# Altium schematic sheet Stepper_control.SchDoc: Stepper Control
size A3; DrawnBy: Mogens Groth Nicolaisen; DocumentNumber: 4; SheetNumber: 4; SheetTotal: 7
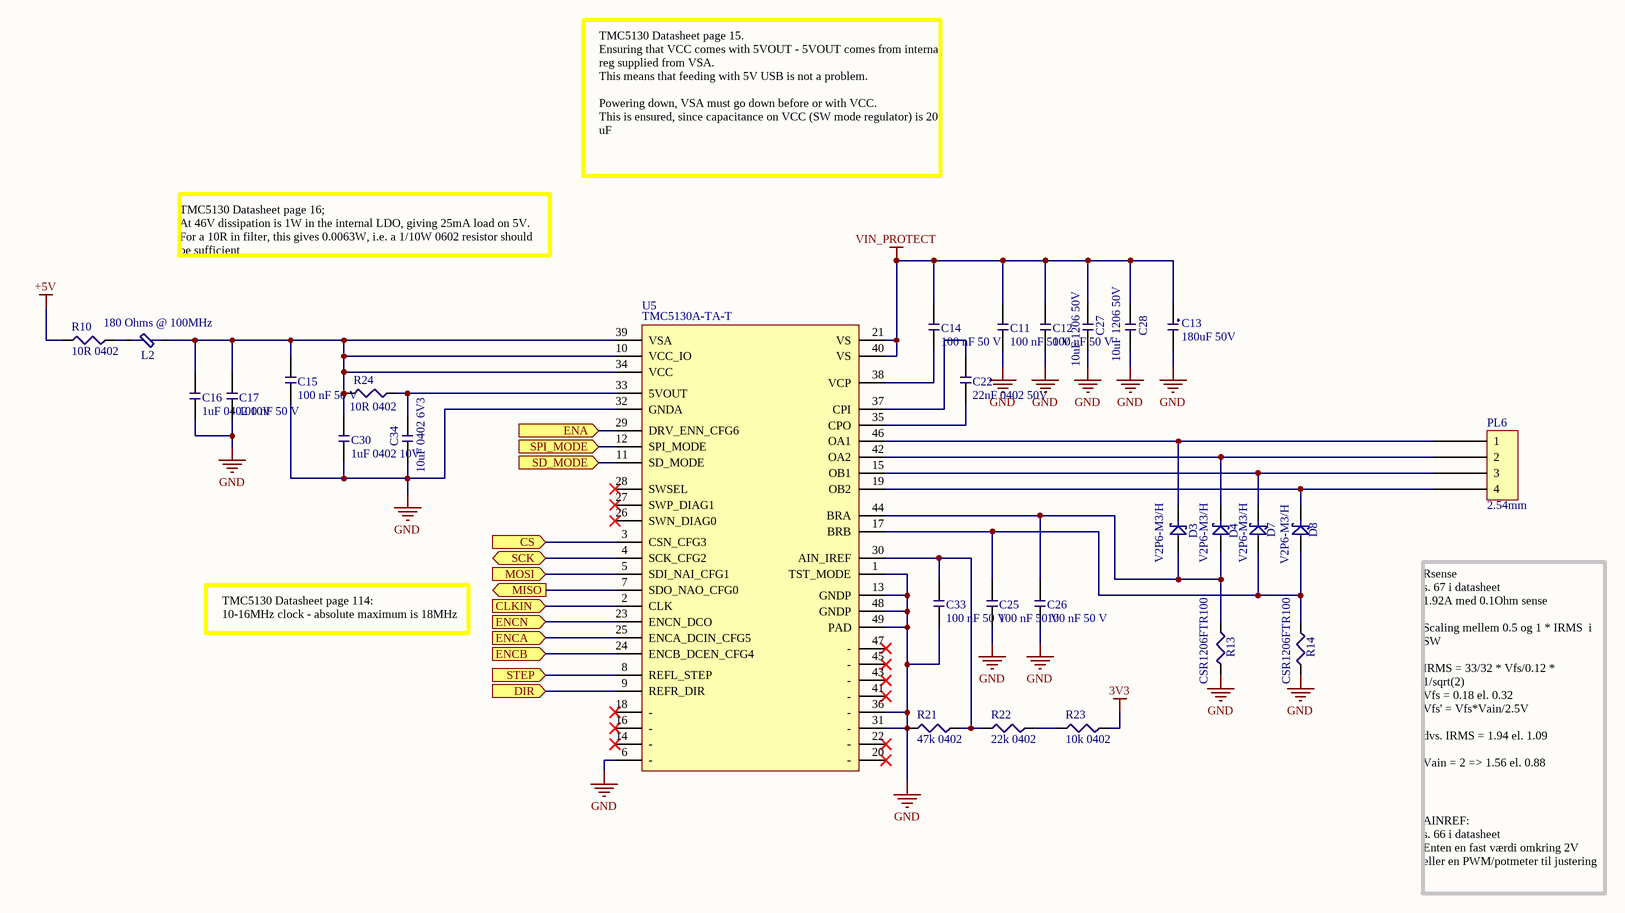
[diagram p0: Stepper_control.SchDoc]

## Parts
C11  100 nF 50 V  [CAP_0402]
C12  100 nF 50 V  [CAP_0402]
C13  180uF 50V  [Capacitor 8x22]
C14  100 nF 50 V  [CAP_0402]
C15  100 nF 50 V  [CAP_0402]
C16  1uF 0402 10V  [CAP_0402]
C17  100 nF 50 V  [CAP_0402]
C22  22nF 0402 50V  [CAP_0402]
C25  100 nF 50 V  [CAP_0402]
C26  100 nF 50 V  [CAP_0402]
C27  10uF 1206 50V  [CAP_1206]
C28  10uF 1206 50V  [CAP_1206]
C30  1uF 0402 10V  [CAP_0402]
C33  100 nF 50 V  [CAP_0402]
C34  10uF 0402 6V3  [CAP_0402]
D3  V2P6-M3/H  [MicroSMP]
D4  V2P6-M3/H  [MicroSMP]
D7  V2P6-M3/H  [MicroSMP]
D8  V2P6-M3/H  [MicroSMP]
L2  180 Ohms @ 100MHz  [IND_0603]
PL6  2.54mm  [4-pin 2.54mm header]
R10  10R 0402  [RES_0402]
R13  CSR1206FTR100  [RES_1206]
R14  CSR1206FTR100  [RES_1206]
R21  47k 0402  [RES_0402]
R22  22k 0402  [RES_0402]
R23  10k 0402  [RES_0402]
R24  10R 0402  [RES_0402]
U5  TMC5130A-TA-T  [TSQFP50P900X900X120_HS-49N]

## Ports
CLKIN (in), CS (in), DIR (in), ENA (in), ENCA (in), ENCB (in), ENCN (in), MISO (out), MOSI (in), SCK (bidir), SD_MODE (in), SPI_MODE (in), STEP (in)

## Nets
3V3: R23.1
+5V: R10.2
GND: C11.2 C12.2 C13.2 C15.2 C16.1 C17.2 C25.2 C26.2 C27.2 C28.2 C30.1 C33.2 C34.1 R13.1 R14.1 R21.2 U5.1(TST_MODE) U5.6(-) U5.13(GNDP) U5.31(-) U5.32(GNDA) U5.36(-) U5.48(GNDP) U5.49(PAD)
VIN_PROTECT: C11.1 C12.1 C13.1 C14.2 C27.1 C28.1 U5.21(VS) U5.40(VS)
CLKIN: U5.2(CLK) ; port CLKIN
CS: U5.3(CSN_CFG3) ; port CS
DIR: U5.9(REFR_DIR) ; port DIR
ENA: U5.29(DRV_ENN_CFG6) ; port ENA
ENCA: U5.25(ENCA_DCIN_CFG5) ; port ENCA
ENCB: U5.24(ENCB_DCEN_CFG4) ; port ENCB
ENCN: U5.23(ENCN_DCO) ; port ENCN
MISO: U5.7(SDO_NAO_CFG0) ; port MISO
MOSI: U5.5(SDI_NAI_CFG1) ; port MOSI
SCK: U5.4(SCK_CFG2) ; port SCK
SD_MODE: U5.11(SD_MODE) ; port SD_MODE
SPI_MODE: U5.12(SPI_MODE) ; port SPI_MODE
STEP: U5.8(REFL_STEP) ; port STEP
NetC14_1: C14.1 U5.38(VCP)
NetC15_1: C15.1 C16.2 C17.1 C30.2 L2.2 R24.1 U5.10(VCC_IO) U5.34(VCC) U5.39(VSA)
NetC22_1: C22.1 U5.35(CPO)
NetC22_2: C22.2 U5.37(CPI)
NetC25_1: C25.1 D7.1 D8.1 R14.2 U5.17(BRB)
NetC26_1: C26.1 D3.1 D4.1 R13.2 U5.44(BRA)
NetC33_1: C33.1 R21.1 R22.1 U5.30(AIN_IREF)
NetC34_2: C34.2 R24.2 U5.33(5VOUT)
NetD3_2: D3.2 PL6.1 U5.46(OA1)
NetD4_2: D4.2 PL6.2 U5.42(OA2)
NetD7_2: D7.2 PL6.3 U5.15(OB1)
NetD8_2: D8.2 PL6.4 U5.19(OB2)
NetL2_1: L2.1 R10.1
NetR22_2: R22.2 R23.2

Not connected (* = marked no-connect by the designer): U5 14(-)* 16(-)* 18(-)* 20(-)* 22(-)* 26(SWN_DIAG0)* 27(SWP_DIAG1)* 28(SWSEL)* 41(-)* 43(-)* 45(-)* 47(-)*

## Notes on the sheet
- TMC5130 Datasheet page 15.
  Ensuring that VCC comes with 5VOUT - 5VOUT comes from internal reg supplied from VSA.
  This means that feeding with 5V USB is not a problem.
  Powering down, VSA must go down before or with VCC.
  This is ensured, since capacitance on VCC (SW mode regulator) is 20 uF
- TMC5130 Datasheet page 16;
  At 46V dissipation is 1W in the internal LDO, giving 25mA load on 5V.
  For a 10R in filter, this gives 0.0063W, i.e. a 1/10W 0602 resistor should be sufficient
- TMC5130 Datasheet page 114:
  10-16MHz clock - absolute maximum is 18MHz
- Rsense
  s. 67 i datasheet
  1.92A med 0.1Ohm sense
  Scaling mellem 0.5 og 1 * IRMS  i SW
  IRMS = 33/32 * Vfs/0.12 * 1/sqrt(2)
  Vfs = 0.18 el. 0.32
  Vfs' = Vfs*Vain/2.5V
  dvs. IRMS = 1.94 el. 1.09
  Vain = 2 => 1.56 el. 0.88
- AINREF:
  s. 66 i datasheet
  Enten en fast værdi omkring 2V eller en PWM/potmeter til justering
- ON Development
- Title:
- Size:
- A3
- Drawn By:
- Date:
- Sheet
- of
- Revision:

## Library data of the parts
C11 C12 C14 C15 C17 C33 = CMP-00088-2: Multilayer Ceramic Capacitors MLCC - SMD/SMT .1uF 50Volts X7R +/-10% 0402 STD; Tolerance: 10%; Value: 100nF; Voltage: 50 V; Voltage Rating: 50V; Mount: Surface Mount; Case/Package: 0402; Case Code (Imperial): 0402; Case Code (Metric): 1005; Min Operating Temperature: -55°C; Max Operating Temperature: 125°C; Capacitance: 100nF; Voltage Rating (DC): 50V; Packaging: Tape and Reel; Package Quantity: 10000; Dielectric: X7R; Termination: SMD/SMT; Length: 0.039inch; Height: 0.5mm; Width: 0.5mm; Thickness: 0.022inch; Lead Free: Lead Free; Halogen Free: Halogen Free
C13 = CMP-002-0003-4: 180UF 20% 50V 105DEG RADIAL; Case/Package: -; Tolerance: 20%; Value: 180uF
C16 C30 = CMP-00032-5: 1uF 0402 10V 10% X5R; Material: Ceramic; Tolerance: 10%; Value: 1 uF; Voltage: 10 V; Capacitance: 1uF; Case/Package: 0402; Case Code (Imperial): 0402; Case Code (Metric): 1005; Contact Plating: Tin; Depth: 0.5mm; Dielectric: X5R; Height: 0.5mm; Length: 1mm; Max Operating Temperature: 85°C; Min Operating Temperature: -55°C; Mount: Surface Mount; Package Quantity: 1; Packaging: Tape and Reel; Radiation Hardening: No; Thickness: 0.022inch; Voltage Rating: 10V; Width: 0.02inch
C22 = CMP-00045-5: 22nF 0402 50V X7R 10%; Mfg. Part Number: GRM155R71H223KA12D; Tolerance: 10%; Value: 22nF; Voltage: 50V
C25 C26 = CMP-00088-2: Multilayer Ceramic Capacitors MLCC - SMD/SMT .1uF 50Volts X7R +/-10% 0402 STD; Tolerance: 10%; Value: 100nF; Voltage: 50 V; Voltage Rating (DC): 50V; Capacitance: 100nF; Case/Package: 0402; Case Code (Imperial): 0402; Case Code (Metric): 1005; Dielectric: X7R; Halogen Free: Halogen Free; Height: 0.5mm; Lead Free: Lead Free; Length: 0.039inch; Max Operating Temperature: 125°C; Min Operating Temperature: -55°C; Mount: Surface Mount; Package Quantity: 10000; Packaging: Tape and Reel; Termination: SMD/SMT; Thickness: 0.022inch; Voltage Rating: 50V; Width: 0.5mm
C27 C28 = CMP-00030-4: 10uF 1206 50V X5R 20%; Tolerance: +/- 20%; Value: 10uF; Voltage: 50 V
C34 = CMP-00011-3: 10uF 20% 0402 6V3 X6S; Current Rating: -; Tolerance: 20%; Value: 10uF; Voltage: 6V3
D3 D4 D7 D8 = CMP-016-0002-2: DIODE SCHOTTKY 60V 2A MICROSMP
L2 = CMP-ROOT-0005-2: FERRITE BEAD 180 OHM 0603 1LN; Mfg. Part Number: BLM18PG181SN1D; Current: 1.5A; Value: 180 Ohm; Case/Package: 0603
PL6 = CMP-003-0003-3: Pin header 4-pin 2.54mm male; Mfg. Part Number: DS1021-1*4SF1-1
R10 R24 = CMP-001-0033-3: RES SMD 10 OHM 1% 1/16W 0402; Mfg. Part Number: 0402WGF100JTCE; Power: 63mW; Case/Package: 0402; Tolerance: 1%; Value: 10R
R13 R14 = CMP-001-0024-3: RES 0.1 OHM 1% 1/2W 1206; Power: 0.5W; Value: 0R1; Case/Package: 1206; Tolerance: 1%; Mfg. Part Number: CSR1206FTR100
R21 = CMP-001-0027-3: RES SMD 47K OHM 1% 1/16W 0402; Mfg. Part Number: RMCF0402FT47K0; Case/Package: 0402; Power: 1/16W; Tolerance: 1%; Value: 47k
R22 = CMP-001-0026-3: RES SMD 22K OHM 1% 1/16W 0402; Mfg. Part Number: RMCF0402FT22K0; Case/Package: 0402; Power: 1/16W; Tolerance: 1%; Value: 22k
R23 = CMP-001-0019-3: RES SMD 10K OHM 1% 1/16W 0402; Mfg. Part Number: RMCF0402FT10K0; Case/Package: 0402; Power: 1/16 W; Tolerance: 1 %; Value: 10k
U5 = CMP-00034-3: IC MOTOR CTLR/DVR SPI 48QFP; Mfg. Part Number: TMC5130A-TA-T